# Altium schematic sheet Audio_Codec.SchDoc: Audio Codec
size 279 x 215 mm; DrawnBy: Connor Dack; Engineer: Connor Dack; DocumentNumber: 5; Revision: 1.0; SheetNumber: 5; SheetTotal: 11
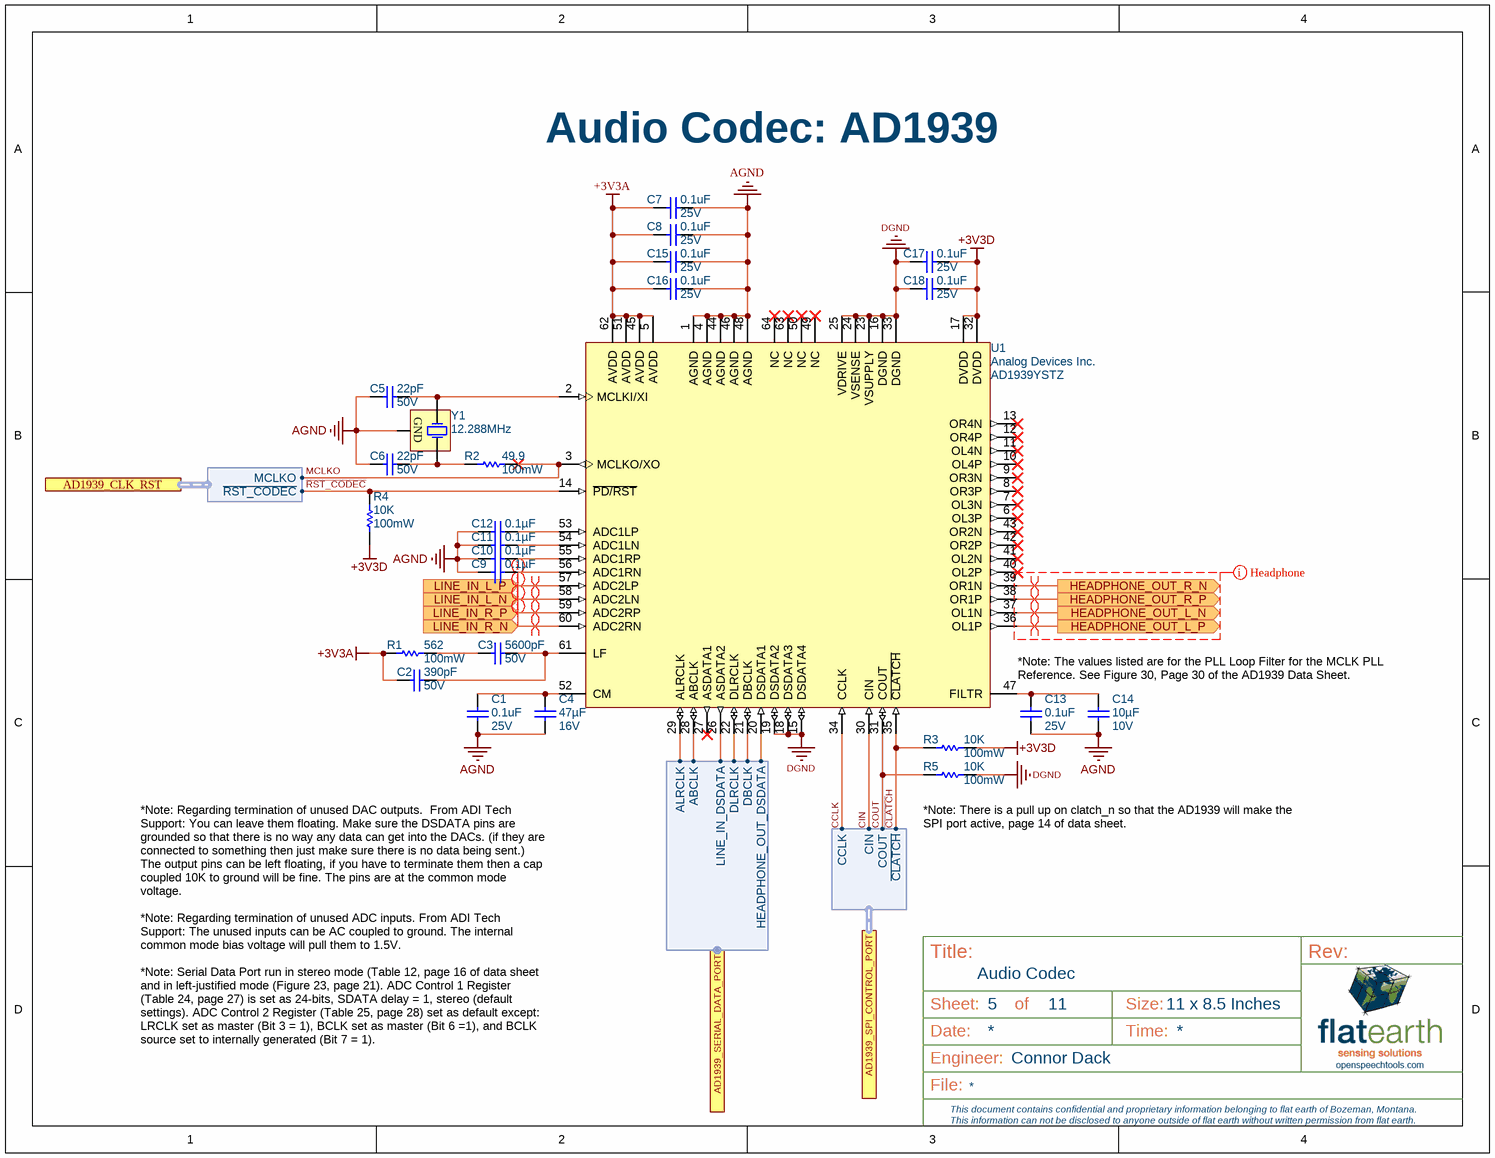
[diagram p0: Audio_Codec.SchDoc]

## Parts
C1  Voltage Rating: 25V  Capacitance: 0.1uF  [3-0603_L]  (hidden comment: CGA3E2X7R1E104K080AA)
C2  Voltage - Rated: 50V  Capacitance: 390pF  [3-0603_L]  (hidden comment: CL10B391KB8NNNC)
C3  Voltage - Rated: 50V  Capacitance: 5600pF  [3-0603_L]  (hidden comment: CL10B562KB8SFNC)
C4  Voltage - Rated: 16V  Capacitance: 47µF  [C1210X25_L]  (hidden comment: GRM32EC81C476KE15L)
C5  Voltage Rating: 50V  Capacitance: 22pF  [3-0603_L]  (hidden comment: CGA3E2C0G1H220J080AA)
C6  Voltage Rating: 50V  Capacitance: 22pF  [3-0603_L]  (hidden comment: CGA3E2C0G1H220J080AA)
C7  Voltage Rating: 25V  Capacitance: 0.1uF  [3-0603_L]  (hidden comment: CGA3E2X7R1E104K080AA)
C8  Voltage Rating: 25V  Capacitance: 0.1uF  [3-0603_L]  (hidden comment: CGA3E2X7R1E104K080AA)
C9  Capacitance: 0.1µF  [2-0402_L]  (hidden comment: CGA2B3X7R1H104K050BB)
C10  Capacitance: 0.1µF  [2-0402_L]  (hidden comment: CGA2B3X7R1H104K050BB)
C11  Capacitance: 0.1µF  [2-0402_L]  (hidden comment: CGA2B3X7R1H104K050BB)
C12  Capacitance: 0.1µF  [2-0402_L]  (hidden comment: CGA2B3X7R1H104K050BB)
C13  Voltage Rating: 25V  Capacitance: 0.1uF  [3-0603_L]  (hidden comment: CGA3E2X7R1E104K080AA)
C14  Voltage - Rated: 10V  Capacitance: 10µF  [3-0603_L]  (hidden comment: C1608X5R1A106K)
C15  Voltage Rating: 25V  Capacitance: 0.1uF  [3-0603_L]  (hidden comment: CGA3E2X7R1E104K080AA)
C16  Voltage Rating: 25V  Capacitance: 0.1uF  [3-0603_L]  (hidden comment: CGA3E2X7R1E104K080AA)
C17  Voltage Rating: 25V  Capacitance: 0.1uF  [3-0603_L]  (hidden comment: CGA3E2X7R1E104K080AA)
C18  Voltage Rating: 25V  Capacitance: 0.1uF  [3-0603_L]  (hidden comment: CGA3E2X7R1E104K080AA)
R1  Power (Watts): 100mW  Resistance (Ohms): 562  [3-0603_R_L]  (hidden comment: ERJ-3EKF5620V)
R2  Power (Watts): 100mW  Resistance (Ohms): 49.9  [3-0603_R_L]  (hidden comment: ERJ-3EKF49R9V)
R3  Power (Watts): 100mW  Resistance (Ohms): 10K  [3-0603_R_L]  (hidden comment: ERJ-3GEYJ103V)
R4  Power (Watts): 100mW  Resistance (Ohms): 10K  [3-0603_R_L]  (hidden comment: ERJ-3GEYJ103V)
R5  Power (Watts): 100mW  Resistance (Ohms): 10K  [3-0603_R_L]  (hidden comment: ERJ-3GEYJ103V)
U1  AD1939YSTZ  Manufacturer: Analog Devices Inc.  [ST_64_2]
Y1  Frequency: 12.288MHz  [ADM3B]  (hidden comment: ABM3B-12.288MHZ-10-1-U-T)

## Ports
AD1939_CLK_RST (harness AD1939_CLK_RST), AD1939_SERIAL_DATA_PORT (harness AD19319_Serial_Data_Port), AD1939_SPI_CONTROL_PORT (harness SPI_Audio_Codec), HEADPHONE_OUT_L_N (out), HEADPHONE_OUT_L_P (out), HEADPHONE_OUT_R_N (out), HEADPHONE_OUT_R_P (out), LINE_IN_L_N (in), LINE_IN_L_P (in), LINE_IN_R_N (in), LINE_IN_R_P (in)

## Harnesses
SPI_Audio_Codec: CIN, COUT, CCLK, ~{CLATCH}
AD19319_Serial_Data_Port: ABCLK, ALRCLK, LINE_IN_DSDATA, DLRCLK, DBCLK, HEADPHONE_OUT_DSDATA
AD1939_CLK_RST: ~{RST_CODEC}, MCLKO

## Nets
+3V3A: C2.1 C7.1 C8.2 C15.1 C16.1 R1.1 U1.5(AVDD) U1.45(AVDD) U1.51(AVDD) U1.62(AVDD)
+3V3D: C17.2 C18.1 R3.1 R4.1 U1.17(DVDD) U1.32(DVDD)
AGND: C1.1 C4.2 C5.1 C6.1 C7.2 C8.1 C9.2 C10.2 C11.2 C12.2 C13.1 C14.1 C15.2 C16.2 U1.1(AGND) U1.4(AGND) U1.44(AGND) U1.46(AGND) U1.48(AGND) Y1.2(GND)
DGND: C17.1 C18.2 R5.1 U1.15(DSDATA4) U1.16(DGND) U1.18(DSDATA3) U1.19(DSDATA2) U1.23(VSUPPLY) U1.24(VSENSE) U1.25(VDRIVE) U1.33(DGND)
~{CLATC}H: R3.2 U1.35(~{CLATCH}) ; port AD1939_SPI_CONTROL_PORT.~{CLATCH}
CCLK: U1.34(CCLK) ; port AD1939_SPI_CONTROL_PORT.CCLK
CIN: U1.30(CIN) ; port AD1939_SPI_CONTROL_PORT.CIN
COUT: R5.2 U1.31(COUT) ; port AD1939_SPI_CONTROL_PORT.COUT
HEADPHONE_OUT_L_N: U1.37(OL1N) ; port HEADPHONE_OUT_L_N
HEADPHONE_OUT_L_P: U1.36(OL1P) ; port HEADPHONE_OUT_L_P
HEADPHONE_OUT_R_N: U1.39(OR1N) ; port HEADPHONE_OUT_R_N
HEADPHONE_OUT_R_P: U1.38(OR1P) ; port HEADPHONE_OUT_R_P
LINE_IN_L_N: U1.58(ADC2LN) ; port LINE_IN_L_N
LINE_IN_L_P: U1.57(ADC2LP) ; port LINE_IN_L_P
LINE_IN_R_N: U1.60(ADC2RN) ; port LINE_IN_R_N
LINE_IN_R_P: U1.59(ADC2RP) ; port LINE_IN_R_P
MCLKO: R2.2 U1.3(MCLKO/XO) ; port AD1939_CLK_RST.MCLKO
~{RST_CODEC}: R4.2 U1.14(~{PD/RST}) ; port AD1939_CLK_RST.~{RST_CODEC}
NetC1_2: C1.2 C4.1 U1.52(CM)
NetC2_2: C2.2 C3.2 U1.61(LF)
NetC3_1: C3.1 R1.2
NetC5_2: C5.2 U1.2(MCLKI/XI) Y1.1(OSC1)
NetC6_2: C6.2 R2.1 Y1.3(OSC2)
NetC9_1: C9.1 U1.56(ADC1RN)
NetC10_1: C10.1 U1.55(ADC1RP)
NetC11_1: C11.1 U1.54(ADC1LN)
NetC12_1: C12.1 U1.53(ADC1LP)
NetC13_2: C13.2 C14.2 U1.47(FILTR)
NetU1_20: U1.20(DSDATA1) ; port AD1939_SERIAL_DATA_PORT.HEADPHONE_OUT_DSDATA
NetU1_21: U1.21(DBCLK) ; port AD1939_SERIAL_DATA_PORT.DBCLK
NetU1_22: U1.22(DLRCLK) ; port AD1939_SERIAL_DATA_PORT.DLRCLK
NetU1_26: U1.26(ASDATA2) ; port AD1939_SERIAL_DATA_PORT.LINE_IN_DSDATA
NetU1_28: U1.28(ABCLK) ; port AD1939_SERIAL_DATA_PORT.ABCLK
NetU1_29: U1.29(ALRCLK) ; port AD1939_SERIAL_DATA_PORT.ALRCLK

Not connected (* = marked no-connect by the designer): U1 6(OL3P)* 7(OL3N)* 8(OR3P)* 9(OR3N)* 10(OL4P)* 11(OL4N)* 12(OR4P)* 13(OR4N)* 27(ASDATA1)* 40(OL2P)* 41(OL2N)* 42(OR2P)* 43(OR2N)* 49(NC)* 50(NC)* 63(NC)* 64(NC)*

## Layout directives
differential pair: HEADPHONE_OUT_L_N, HEADPHONE_OUT_L_P, HEADPHONE_OUT_R_N, HEADPHONE_OUT_R_P, LINE_IN_L_N, LINE_IN_L_P, LINE_IN_R_N, LINE_IN_R_P
net class Headphone: (no net found under the mark)
net class LINE_IN: LINE_IN_L_N, LINE_IN_L_P, LINE_IN_R_N, LINE_IN_R_P

## Notes on the sheet
- Audio Codec: AD1939
- *Note: The values listed are for the PLL Loop Filter for the MCLK PLL Reference. See Figure 30, Page 30 of the AD1939 Data Sheet.
- (near R5) *Note: There is a pull up on clatch_n so that the AD1939 will make the SPI port active, page 14 of data sheet.
- *Note: Regarding termination of unused DAC outputs.  From ADI Tech Support: You can leave them floating. Make sure the DSDATA pins are grounded so that there is no way any data can get into the DACs. (if they are connected to something then just make sure there is no data being sent.) The output pins can be left floating, if you have to terminate them then a cap coupled 10K to ground will be fine. The pins are at the common mode voltage.
  *Note: Regarding termination of unused ADC inputs. From ADI Tech Support: The unused inputs can be AC coupled to ground. The internal common mode bias voltage will pull them to 1.5V.
  *Note: Serial Data Port run in stereo mode (Table 12, page 16 of data sheet and in left-justified mode (Figure 23, page 21). ADC Control 1 Register (Table 24, page 27) is set as 24-bits, SDATA delay = 1, stereo (default settings). ADC Control 2 Register (Table 25, page 28) set as default except: LRCLK set as master (Bit 3 = 1), BCLK set as master (Bit 6 =1), and BCLK source set to internally generated (Bit 7 = 1).
- Title:
- Rev:
- Sheet:
- Date:
- of
- Time:
- Size:
- 11 x 8.5 Inches
- Engineer:
- File:
- This document contains confidential and proprietary information belonging to flat earth of Bozeman, Montana.
  This information can not be disclosed to anyone outside of flat earth without written permission from flat earth.

## Library data of the parts
C1 C7 C8 C13 C15-C18 = CGA3E2X7R1E104K080AA: CAP CER 0.1UF 25V X7R 0603; Manufacturer: TDK; Tolerance: 10%; ComponentLink1URL: https://datasheet.ciiva.com/24218/cga3e2x7r1h332k080aa-266003-24218741.pdf; ComponentLink1Description: https://datasheet.ciiva.com/24218/cga3e2x7r1h332k080aa-266003-24218741.pdf; Supplier 1: Digi-Key; Manufacturer Part Number: CGA3E2X7R1E104K080AA; Stock 1: 170098; Pricing 1: 1=0.1, 10=0.063, 100=0.0279, 500=0.0199, 1000=0.0156 (USD); Mount: Surface Mount; Case/Package: 0603; Weight: 7.1E-05oz; Case Code (Metric): 1608; Case Code (Imperial): 0603; Min Operating Temperature: -55°C; Max Operating Temperature: 125°C; Packaging: Tape and Reel; Package Quantity: 1; Voltage Rating (DC): 25V; Dielectric: X7R; Termination: SMD/SMT; Composition: Ceramic; Length: 1.6mm; Height: 0.8mm; Width: 0.031inch; Thickness: 0.035inch; Depth: 0.8mm; REACH SVHC: No SVHC; Lead Free: Lead Free; ComponentLink2URL: https://datasheet.ciiva.com/22725/1735392-22725638.pdf; ComponentLink2Description: https://datasheet.ciiva.com/22725/1735392-22725638.pdf; ComponentLink3URL: https://datasheet.ciiva.com/24220/cga3e2x7r1e104k080aa-265934-24220022.pdf; ComponentLink3Description: https://datasheet.ciiva.com/24220/cga3e2x7r1e104k080aa-265934-24220022.pdf; ComponentLink4URL: https://datasheet.ciiva.com/22725/1735392-22725639.pdf; ComponentLink4Description: https://datasheet.ciiva.com/22725/1735392-22725639.pdf; ComponentLink5URL: https://datasheet.ciiva.com/16427/mlccspec-automotive-general-midvoltage-en-16427320.pdf; ComponentLink5Description: https://datasheet.ciiva.com/16427/mlccspec-automotive-general-midvoltage-en-16427320.pdf; ComponentLink6URL: https://datasheet.ciiva.com/23803/1735392-23803082.pdf; ComponentLink6Description: https://datasheet.ciiva.com/23803/1735392-23803082.pdf; Supplier Part Number 1: 445-5667-6-ND
C2 = CL10B391KB8NNNC: 390pF 50V Ceramic Capacitor X7R 0603 (1608 Metric) 0.063" L x 0.031" W (1.60mm x 0.80mm); Manufacturer: Samsung Electro-Mechanics America, Inc.; Tolerance: ±10%; Supplier 1: Digi-Key; Manufacturer Part Number: CL10B391KB8NNNC; RoHS: RoHS Compliant; Category: Capacitors; Stock 1: 10890; Pricing 1: 1=0.1, 10=0.035, 25=0.0248, 50=0.0192, 100=0.0162, 500=0.01132, 1000=0.00882 (USD); Packaging: Cut Tape (CT); Part Status: Active; Temperature Coefficient: X7R; Mounting Type: Surface Mount, MLCC; Operating Temperature: -55°C ~ 125°C; Applications: General Purpose; Ratings: -; Package / Case: 0603 (1608 Metric); Size / Dimension: 0.063" L x 0.031" W (1.60mm x 0.80mm); Height - Seated (Max): -; Thickness (Max): 0.035" (0.90mm); Lead Spacing: -; Features: -; Lead Style: -; ComponentLink1URL: http://www.samsungsem.com/kr/support/product-search/mlcc/__icsFiles/afieldfile/2016/08/18/S_CL10B391KB8NNNC.pdf; ComponentLink1Description: http://www.samsungsem.com/kr/support/product-search/mlcc/__icsFiles/afieldfile/2016/08/18/S_CL10B391KB8NNNC.pdf; Supplier Part Number 1: 1276-2049-1-ND; Load Status: *
C3 = CL10B562KB8SFNC: 5600pF 50V Ceramic Capacitor X7R 0603 (1608 Metric) 0.063" L x 0.031" W (1.60mm x 0.80mm); Manufacturer: Samsung Electro-Mechanics America, Inc.; Tolerance: ±10%; Supplier 1: Digi-Key; Manufacturer Part Number: CL10B562KB8SFNC; RoHS: RoHS Compliant; Category: Capacitors; Stock 1: 35381; Pricing 1: 1=0.1, 10=0.048, 25=0.034, 50=0.0262, 100=0.0221, 500=0.01548, 1000=0.01206 (USD); Packaging: Cut Tape (CT); Part Status: Active; Temperature Coefficient: X7R; Mounting Type: Surface Mount, MLCC; Operating Temperature: -55°C ~ 125°C; Applications: Boardflex Sensitive; Ratings: -; Package / Case: 0603 (1608 Metric); Size / Dimension: 0.063" L x 0.031" W (1.60mm x 0.80mm); Height - Seated (Max): -; Thickness (Max): 0.035" (0.90mm); Lead Spacing: -; Features: Soft Termination; Lead Style: -; ComponentLink1URL: http://www.samsungsem.com/kr/support/product-search/mlcc/__icsFiles/afieldfile/2016/08/18/S_CL10B562KB8SFNC.pdf; ComponentLink1Description: http://www.samsungsem.com/kr/support/product-search/mlcc/__icsFiles/afieldfile/2016/08/18/S_CL10B562KB8SFNC.pdf; Supplier Part Number 1: 1276-2092-1-ND; Load Status: *
C4 = GRM32EC81C476KE15L: 47µF ±10% 16V Ceramic Capacitor X6S 1210 (3225 Metric); Manufacturer: Murata Electronics North America; Supplier 1: Digi-Key; Manufacturer Part Number: GRM32EC81C476KE15L; RoHS: RoHS Compliant; Category: Capacitors; Stock 1: 39641; Pricing 1: 1=0.73, 10=0.697, 25=0.4944, 50=0.4164, 100=0.3383, 250=0.28108, 500=0.25504 (USD); Packaging: Cut Tape (CT); Tolerance: ±10%; Temperature Coefficient: X6S; Mounting Type: Surface Mount, MLCC; Operating Temperature: -55°C ~ 105°C; Applications: General Purpose; Ratings: -; Package / Case: 1210 (3225 Metric); Size / Dimension: 0.126" L x 0.098" W (3.20mm x 2.50mm); Height - Seated (Max): -; Thickness (Max): 0.106" (2.70mm); Lead Spacing: -; Features: Derating Recommended; Lead Style: -; ComponentLink1URL: http://www.murata.com/~/media/webrenewal/support/library/catalog/products/capacitor/mlcc/c02e.pdf; ComponentLink1Description: http://www.murata.com/~/media/webrenewal/support/library/catalog/products/capacitor/mlcc/c02e.pdf; Supplier Part Number 1: 490-10531-1-ND; Part Status: Active; Failure Rate: *; Load Status: *
C5 C6 = CGA3E2C0G1H220J080AA: CAP CER 22PF 50V C0G 0603; Manufacturer: TDK; Tolerance: 5%; ComponentLink1URL: https://datasheet.ciiva.com/24217/cga3e2c0g1h220j080aa-265896-24217329.pdf; ComponentLink1Description: https://datasheet.ciiva.com/24217/cga3e2c0g1h220j080aa-265896-24217329.pdf; Supplier 1: Digi-Key; Manufacturer Part Number: CGA3E2C0G1H220J080AA; Stock 1: 26658; Pricing 1: 1=0.1, 10=0.063, 100=0.0279, 500=0.0199, 1000=0.0156 (USD); Mount: Surface Mount; Case/Package: 0603; Weight: 7.1E-05oz; Case Code (Imperial): 0603; Case Code (Metric): 1608; Min Operating Temperature: -55°C; Max Operating Temperature: 125°C; Voltage Rating (DC): 50V; Packaging: Tape and Reel; Package Quantity: 1; Dielectric: C0G; Termination: SMD/SMT; Composition: Ceramic; Length: 1.6mm; Height: 0.8mm; Width: 0.8mm; Thickness: 0.035inch; Depth: 0.8mm; REACH SVHC: No SVHC; Lead Free: Lead Free; Supplier Part Number 1: 445-5632-6-ND
C9-C12 = CGA2B3X7R1H104K050BB: CAP CER 0.1UF 50V X7R 0402; Manufacturer: TDK Corporation; Tolerance: ±10%; Supplier 1: Digi-Key; Manufacturer Part Number: CGA2B3X7R1H104K050BB; RoHS: RoHS Compliant; Category: Capacitors; Stock 1: 1156628; Pricing 1: 1=0.16, 10=0.11, 100=0.0523, 250=0.044, 500=0.03686, 1000=0.03025, 5000=0.02558 (USD); Packaging: Cut Tape (CT); Part Status: Active; Voltage - Rated: 50V; Temperature Coefficient: X7R; Operating Temperature: -55°C ~ 125°C; Features: -; Ratings: AEC-Q200; Applications: Automotive; Failure Rate: -; Mounting Type: Surface Mount, MLCC; Package / Case: 0402 (1005 Metric); Size / Dimension: 0.039" L x 0.020" W (1.00mm x 0.50mm); Height - Seated (Max): -; Thickness (Max): 0.022" (0.55mm); Lead Spacing: -; Lead Style: -; ComponentLink1URL: https://product.tdk.com/info/en/catalog/datasheets/mlcc_automotive_general_en.pdf; ComponentLink1Description: https://product.tdk.com/info/en/catalog/datasheets/mlcc_automotive_general_en.pdf; Supplier Part Number 1: 445-6899-1-ND
C14 = C1608X5R1A106K: CAP CER 10UF 10V 10% X5R 0603; Manufacturer: TDK Corporation; Supplier 1: Digi-Key; Manufacturer Part Number: C1608X5R1A106K; RoHS: RoHS Compliant; Category: Capacitors; Stock 1: 36523; Pricing 1: 1=0.48, 10=0.42, 100=0.21, 250=0.168, 500=0.153, 1000=0.138 (USD); Tolerance: ±10%; Temperature Coefficient: X5R; Mounting Type: Surface Mount, MLCC; Operating Temperature: -55°C ~ 85°C; Applications: General Purpose; Ratings: -; Package / Case: 0603 (1608 Metric); Size / Dimension: 0.063" L x 0.031" W (1.60mm x 0.80mm); Height - Seated (Max): -; Thickness (Max): 0.035" (0.90mm); Lead Spacing: -; Features: -; Packaging: Cut Tape (CT); Lead Style: -; ComponentLink1URL: http://www.tdk.com/pdf/general_B11.pdf; ComponentLink1Description: http://www.tdk.com/pdf/general_B11.pdf; Supplier Part Number 1: 445-7486-1-ND; Load Status: *
R1 = ERJ-3EKF5620V: RES SMD 562 OHM 1% 1/10W 0603; Manufacturer: Panasonic Electronic Components; Temperature Coefficient: ±100ppm/°C; Supplier 1: Digi-Key; Manufacturer Part Number: ERJ-3EKF5620V; RoHS: RoHS Compliant; Category: Resistors; Stock 1: 336376; Pricing 1: 1=0.1, 50=0.0114, 100=0.0084, 250=0.00644, 500=0.00514, 1000=0.00379 (USD); Packaging: Cut Tape (CT); Part Status: Active; Tolerance: ±1%; Composition: Thick Film; Features: Automotive AEC-Q200; Operating Temperature: -55°C ~ 155°C; Package / Case: 0603 (1608 Metric); Supplier Device Package: 0603; Size / Dimension: 0.063" L x 0.031" W (1.60mm x 0.80mm); Height: 0.022" (0.55mm); Number of Terminations: 2; Failure Rate: -; ComponentLink1URL: http://industrial.panasonic.com/www-cgi/jvcr13pz.cgi?E+PZ+3+AOA0002+ERJ3EKF5620V+7+WW; ComponentLink1Description: http://industrial.panasonic.com/www-cgi/jvcr13pz.cgi?E+PZ+3+AOA0002+ERJ3EKF5620V+7+WW; Supplier Part Number 1: P562HCT-ND; Load Status: *
R2 = ERJ-3EKF49R9V: RES SMD 49.9 OHM 1% 1/10W 0603; Manufacturer: Panasonic Electronic Components; Temperature Coefficient: ±100ppm/°C; Supplier 1: Digi-Key; RoHS: RoHS Compliant; Category: Resistors; Stock 1: 1715606; Pricing 1: 1=0.1, 10=0.019, 25=0.0136, 50=0.0104, 100=0.0077, 250=0.00584, 500=0.00468, 1000=0.00345 (USD); Packaging: Cut Tape (CT); Part Status: Active; Tolerance: ±1%; Composition: Thick Film; Features: Automotive AEC-Q200; Operating Temperature: -55°C ~ 155°C; Package / Case: 0603 (1608 Metric); Supplier Device Package: 0603; Size / Dimension: 0.063" L x 0.031" W (1.60mm x 0.80mm); Height - Seated (Max): 0.022" (0.55mm); Number of Terminations: 2; Failure Rate: -; ComponentLink1URL: http://industrial.panasonic.com/www-cgi/jvcr13pz.cgi?E+PZ+3+AOA0002+ERJ3EKF49R9V+7+WW; ComponentLink1Description: http://industrial.panasonic.com/www-cgi/jvcr13pz.cgi?E+PZ+3+AOA0002+ERJ3EKF49R9V+7+WW; Supplier Part Number 1: P49.9HCT-ND; Load Status: *
R3-R5 = ERJ-3GEYJ103V: RES 10K OHM 1/10W 5% 0603 SMD; Manufacturer: Panasonic - ECG; Temperature Coefficient: ±200ppm/°C; Supplier 1: Digi-Key; Manufacturer Part Number: ERJ-3GEYJ103V; RoHS: RoHS Compliant; Category: Resistors; Stock 1: 16219504; Pricing 1: 1=0.02, 50=0.0092, 100=0.007, 250=0.0052, 500=0.00384, 1000=0.00256 (USD); Composition: Thick Film; Features: -; Tolerance: ±5%; Package / Case: 0603 (1608 Metric); Size / Dimension: 0.063" L x 0.031" W (1.60mm x 0.80mm); Height: 0.022" (0.55mm); Number of Terminations: 2; Packaging: Cut Tape (CT); ComponentLink1URL: http://industrial.panasonic.com/www-cgi/jvcr13pz.cgi?E+PZ+3+AOA0001+ERJ3GEYJ103V+7+WW; ComponentLink1Description: http://industrial.panasonic.com/www-cgi/jvcr13pz.cgi?E+PZ+3+AOA0001+ERJ3GEYJ103V+7+WW; Supplier Part Number 1: P10KGCT-ND; Load Status: *
U1 = AD1939YSTZ: Single-chip codec that prvides 4 ADCs with differential input and 8 DACs with differential output; Data Interface: Serial; Resolution (Bits): 24 b; Number of ADCs / DACs: 4 / 8; Sigma Delta: Yes; S/N Ratio, ADCs / DACs (db) Typ: 94 / 94; Dynamic Range, ADCs / DACs (db) Typ: 105 / 110; Voltage - Supply, Analog: 3 V ~ 3.6 V; Supplier 1: Digi-Key; RoHS: RoHS Compliant; Category: Integrated Circuits (ICs); Stock 1: 432; Pricing 1: 1=15.81, 10=14.527, 100=12.269, 500=10.91416, 1000=10.01091, 2500=9.63456, 5000=9.33348 (USD); Packaging: Tray; Type: General Purpose; Voltage - Supply, Digital: 3 V ~ 3.6 V; Operating Temperature: -40°C ~ 105°C; Mounting Type: Surface Mount; Package / Case: 64-LQFP; Supplier Device Package: 64-LQFP (10x10); ComponentLink1URL: http://www.analog.com/media/en/technical-documentation/data-sheets/AD1939.pdf; ComponentLink1Description: http://www.analog.com/media/en/technical-documentation/data-sheets/AD1939.pdf; Supplier Part Number 1: AD1939YSTZ-ND; Manufacturer Part Number: AD1939YSTZ
Y1 = XTAL_12.288MHz: 12.288MHz ±10ppm Crystal 10pF 70 Ohm -10°C ~ 60°C Surface Mount 4-SMD, No Lead (DFN, LCC); Manufacturer: Abracon LLC; ESR (Equivalent Series Resistance): 70 Ohm; Operating Mode: Fundamental; Supplier 1: Digi-Key; RoHS: RoHS Compliant; Category: Crystals and Oscillators; Stock 1: 1220; Pricing 1: 1=1.09, 10=0.968, 50=0.904, 100=0.8, 500=0.756 (USD); Packaging: Cut Tape (CT); Part Status: Active; Type: MHz Crystal; Frequency Stability: ±10ppm; Frequency Tolerance: ±10ppm; Load Capacitance: 10pF; Operating Temperature: -10°C ~ 60°C; Ratings: -; Mounting Type: Surface Mount; Package / Case: 4-SMD, No Lead (DFN, LCC); Size / Dimension: 0.197" L x 0.126" W (5.00mm x 3.20mm); Height: 0.043" (1.10mm); ComponentLink1URL: http://www.abracon.com/Resonators/abm3b.pdf; ComponentLink1Description: http://www.abracon.com/Resonators/abm3b.pdf; Supplier Part Number 1: 300-8198-1-ND; Manufacturer Part Number: ABM3B-12.288MHZ-10-1-U-T